# EAGLE design H851C (EAGLE 6.6.0)
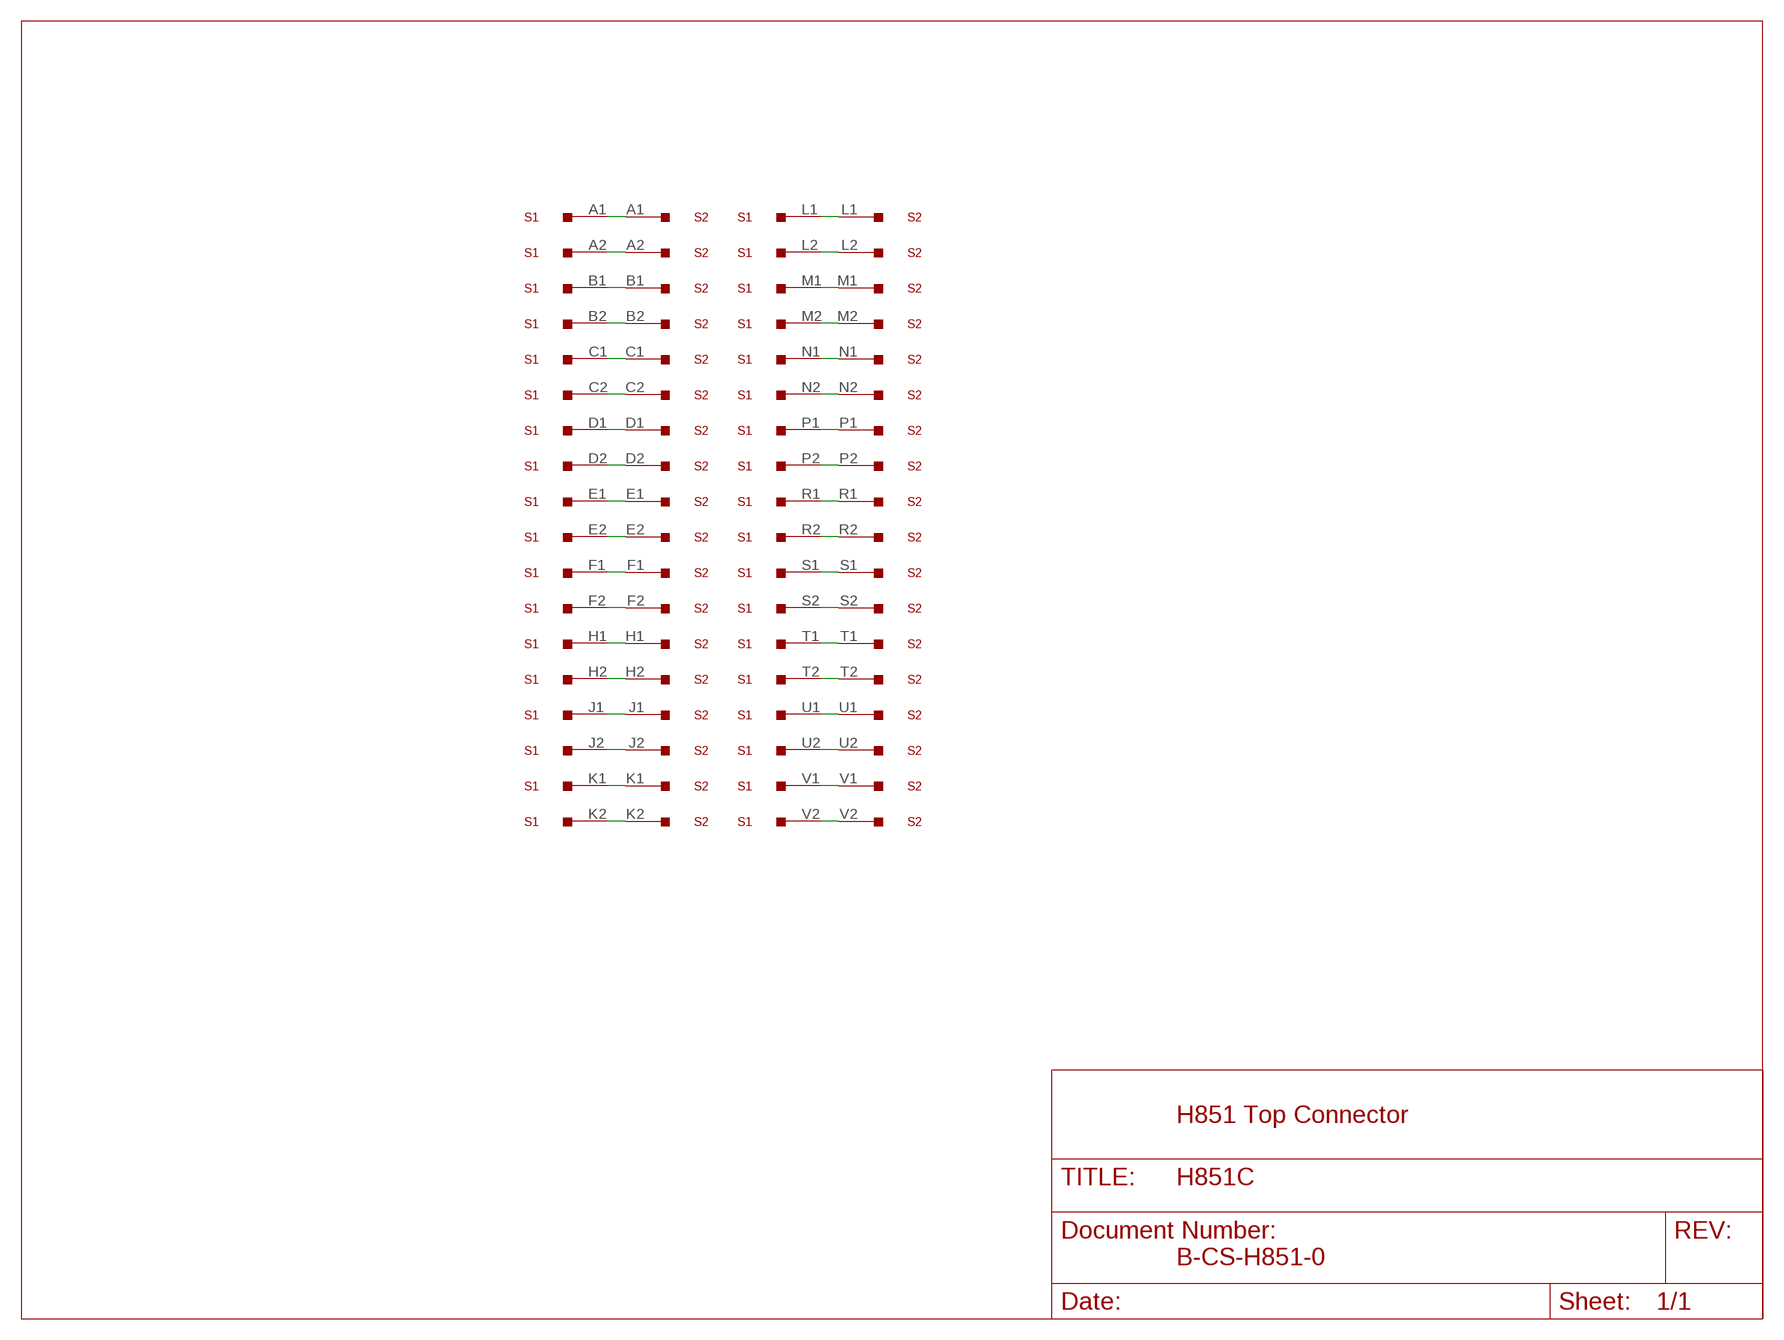
[diagram p0: schematic, sheet 1]

## Parts
S1  M916  [H807]
S2  M916  [H807]

## Nets
N$1: S1.L1 S2.L1
N$2: S1.L2 S2.L2
N$3: S1.M1 S2.M1
N$4: S1.M2 S2.M2
N$5: S1.N1 S2.N1
N$6: S1.N2 S2.N2
N$7: S1.P1 S2.P1
N$8: S1.P2 S2.P2
N$9: S1.R1 S2.R1
N$10: S1.R2 S2.R2
N$11: S1.S1 S2.S1
N$12: S1.S2 S2.S2
N$13: S1.T1 S2.T1
N$14: S1.T2 S2.T2
N$15: S1.U1 S2.U1
N$16: S1.U2 S2.U2
N$17: S1.V1 S2.V1
N$18: S1.V2 S2.V2
N$19: S1.A1 S2.A1
N$20: S1.A2 S2.A2
N$21: S1.B1 S2.B1
N$22: S1.B2 S2.B2
N$23: S1.C1 S2.C1
N$24: S1.C2 S2.C2
N$25: S1.D1 S2.D1
N$26: S1.D2 S2.D2
N$27: S1.E1 S2.E1
N$28: S1.E2 S2.E2
N$29: S1.F1 S2.F1
N$30: S1.F2 S2.F2
N$31: S1.H1 S2.H1
N$32: S1.H2 S2.H2
N$33: S1.J1 S2.J1
N$34: S1.J2 S2.J2
N$35: S1.K1 S2.K1
N$36: S1.K2 S2.K2

## Notes on the sheet
- H851 Top Connector
- B-CS-H851-0

## Library data of the parts
S1 S2 = dec-m:M916: Simple 36 pin connector/wire cable

## Board
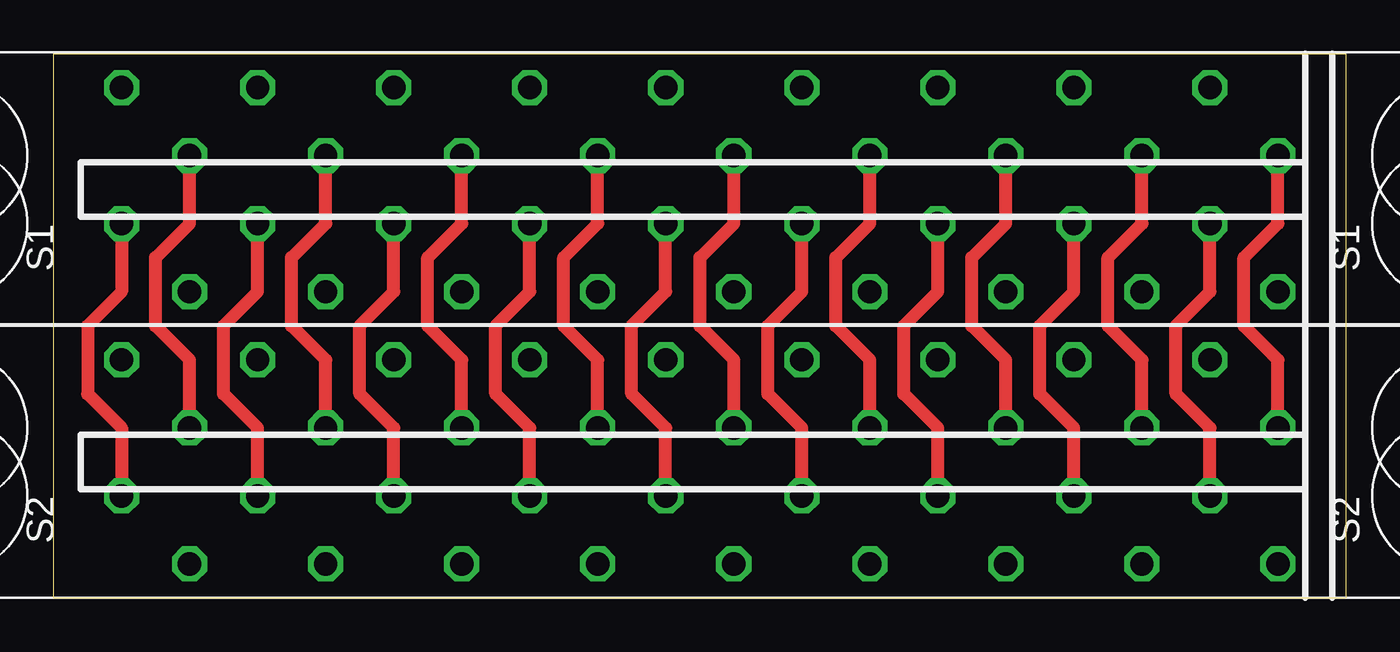
[diagram p1: board, top side]
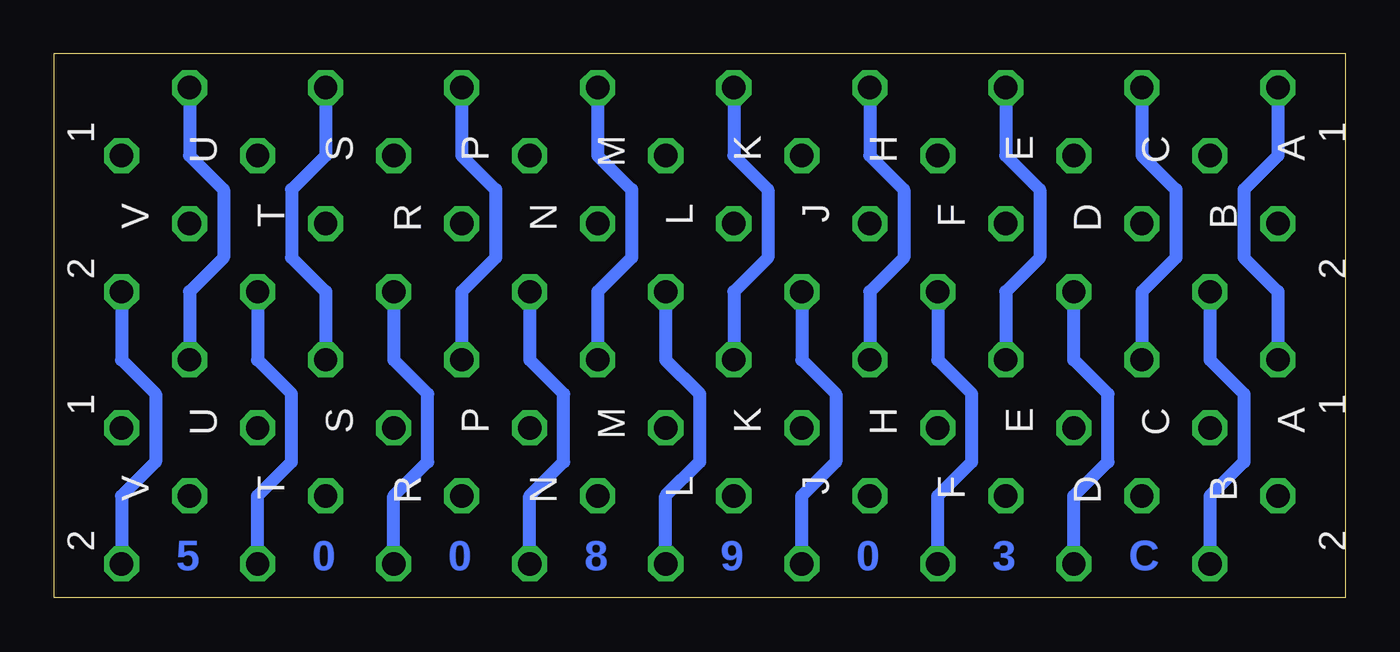
[diagram p2: board, bottom side, seen from below]

Size 60.33 x 25.4 mm. Coordinates in mm from the lower left corner, seen from the top.
Outline: 0,0 0,25.4 60.33,25.4 60.33,0 0,0
Copper layers (1+16): Top 0.035mm / dielectric 1.5mm / Bottom 0.035mm
Design rules "16mils": minimum track width 16mil, minimum drill 32mil, track to track 15mil, track to pad 10mil, pad to pad 10mil, via to via 10mil, smd to smd 10mil, copper to edge 13mil, drill to drill 10mil, minimum pad ring 10mil, minimum via ring 8mil, stop-mask expansion 0mil, vias tented up to drill 0mil, thermal gap 10mil

### Footprints (pad centres in the part's own frame; a part is rotated, then mirrored left to right if it is on the bottom)
H807 = drill 1.092 octagon: A1 4.763,28.575; A2 -1.587,28.575; B1 1.587,25.4; B2 -4.763,25.4; C1 4.763,22.225; C2 -1.587,22.225; D1 1.587,19.05; D2 -4.763,19.05; E1 4.763,15.875; E2 -1.587,15.875; F1 1.587,12.7; F2 -4.763,12.7; H1 4.763,9.525; H2 -1.587,9.525; J1 1.587,6.35; J2 -4.763,6.35; K1 4.763,3.175; K2 -1.587,3.175; L1 1.587,0; L2 -4.763,0; M1 4.763,-3.175; M2 -1.587,-3.175; N1 1.587,-6.35; N2 -4.763,-6.35; P1 4.763,-9.525; P2 -1.587,-9.525; R1 1.587,-12.7; R2 -4.763,-12.7; S1 4.763,-15.875; S2 -1.587,-15.875; T1 1.587,-19.05; T2 -4.763,-19.05; U1 4.763,-22.225; U2 -1.587,-22.225; V1 1.587,-25.4; V2 -4.763,-25.4

### Placement (x,y rotation side)
S1  31.75,19.05 90 top
S2  31.75,6.35 90 top

### Tracks (layer width: path | path; a pad name or v marks a point on that pad's centre or on a via)
N$1
  Top 0.61: S2.L1 31.75,11.11 30.16,12.7 30.16,15.88 31.75,17.46 S1.L1
N$2
  Bottom 0.61: S1.L2 31.75,11.11 30.16,9.53 30.16,6.35 31.75,4.76 S2.L2
N$3
  Bottom 0.61: S1.M1 34.92,20.64 33.34,19.05 33.34,15.88 34.92,14.29 S2.M1
N$4
  Top 0.61: S2.M2 34.92,7.94 33.34,9.53 33.34,12.7 34.92,14.29 S1.M2
N$5
  Top 0.61: S2.N1 38.1,11.11 36.51,12.7 36.51,15.88 38.1,17.46 S1.N1
N$6
  Bottom 0.61: S1.N2 38.1,11.11 36.51,9.53 36.51,6.35 38.1,4.76 S2.N2
N$7
  Bottom 0.61: S1.P1 41.27,20.64 39.69,19.05 39.69,15.88 41.27,14.29 S2.P1
N$8
  Top 0.61: S2.P2 41.27,7.94 39.69,9.53 39.69,12.7 41.27,14.29 S1.P2
N$9
  Top 0.61: S2.R1 44.45,11.11 42.86,12.7 42.86,15.88 44.45,17.46 S1.R1
N$10
  Bottom 0.61: S1.R2 44.45,11.11 42.86,9.53 42.86,6.35 44.45,4.76 S2.R2
N$11
  Bottom 0.61: S1.S1 47.62,20.64 49.21,19.05 49.21,15.88 47.62,14.29 S2.S1
N$12
  Top 0.61: S2.S2 47.62,7.94 46.04,9.53 46.04,12.7 47.62,14.29 S1.S2
N$13
  Top 0.61: S2.T1 50.8,11.11 49.21,12.7 49.21,15.88 50.8,17.46 S1.T1
N$14
  Bottom 0.61: S1.T2 50.8,11.11 49.21,9.53 49.21,6.35 50.8,4.76 S2.T2
N$15
  Bottom 0.61: S1.U1 53.98,20.64 52.39,19.05 52.39,15.88 53.98,14.29 S2.U1
N$16
  Top 0.61: S2.U2 53.98,7.94 52.39,9.53 52.39,12.7 53.98,14.29 S1.U2
N$17
  Top 0.61: S2.V1 57.15,11.11 55.56,12.7 55.56,15.88 57.15,17.46 S1.V1
N$18
  Bottom 0.61: S1.V2 57.15,11.11 55.56,9.53 55.56,6.35 57.15,4.76 S2.V2
N$19
  Bottom 0.61: S1.A1 3.17,20.64 4.76,19.05 4.76,15.88 3.17,14.29 S2.A1
N$20
  Top 0.61: S1.A2 3.17,14.29 1.59,12.7 1.59,9.53 3.17,7.94 S2.A2
N$21
  Top 0.61: S2.B1 6.35,11.11 4.76,12.7 4.76,15.88 6.35,17.46 S1.B1
N$22
  Bottom 0.61: S1.B2 6.35,11.11 4.76,9.53 4.76,6.35 6.35,4.76 S2.B2
N$23
  Bottom 0.61: S1.C1 9.53,20.64 7.94,19.05 7.94,15.88 9.53,14.29 S2.C1
N$24
  Top 0.61: S2.C2 9.53,7.94 7.94,9.53 7.94,12.7 9.53,14.29 S1.C2
N$25
  Top 0.61: S2.D1 12.7,11.11 11.11,12.7 11.11,15.88 12.7,17.46 S1.D1
N$26
  Bottom 0.61: S2.D2 12.7,4.76 11.11,6.35 11.11,9.53 12.7,11.11 S1.D2
N$27
  Bottom 0.61: S1.E1 15.88,20.64 14.29,19.05 14.29,15.88 15.88,14.29 S2.E1
N$28
  Top 0.61: S2.E2 15.88,7.94 14.29,9.53 14.29,12.7 15.88,14.29 S1.E2
N$29
  Top 0.61: S2.F1 19.05,11.11 17.46,12.7 17.46,15.88 19.05,17.46 S1.F1
N$30
  Bottom 0.61: S1.F2 19.05,11.11 17.46,9.53 17.46,6.35 19.05,4.76 S2.F2
N$31
  Bottom 0.61: S1.H1 22.23,20.64 20.64,19.05 20.64,15.88 22.23,14.29 S2.H1
N$32
  Top 0.61: S2.H2 22.23,7.94 20.64,9.53 20.64,12.7 22.23,14.29 S1.H2
N$33
  Top 0.61: S2.J1 25.4,11.11 23.81,12.7 23.81,15.88 25.4,17.46 S1.J1
N$34
  Bottom 0.61: S1.J2 25.4,11.11 23.81,9.53 23.81,6.35 25.4,4.76 S2.J2
N$35
  Bottom 0.61: S1.K1 28.57,20.64 26.99,19.05 26.99,15.88 28.57,14.29 S2.K1
N$36
  Top 0.61: S2.K2 28.57,7.94 26.99,9.53 26.99,12.7 28.57,14.29 S1.K2

### Text on the board
Bottom: C | 3 | 0 | 9 | 8 | 0 | 0 | 5